# EAGLE design NU32v7 (EAGLE 7.3.0)
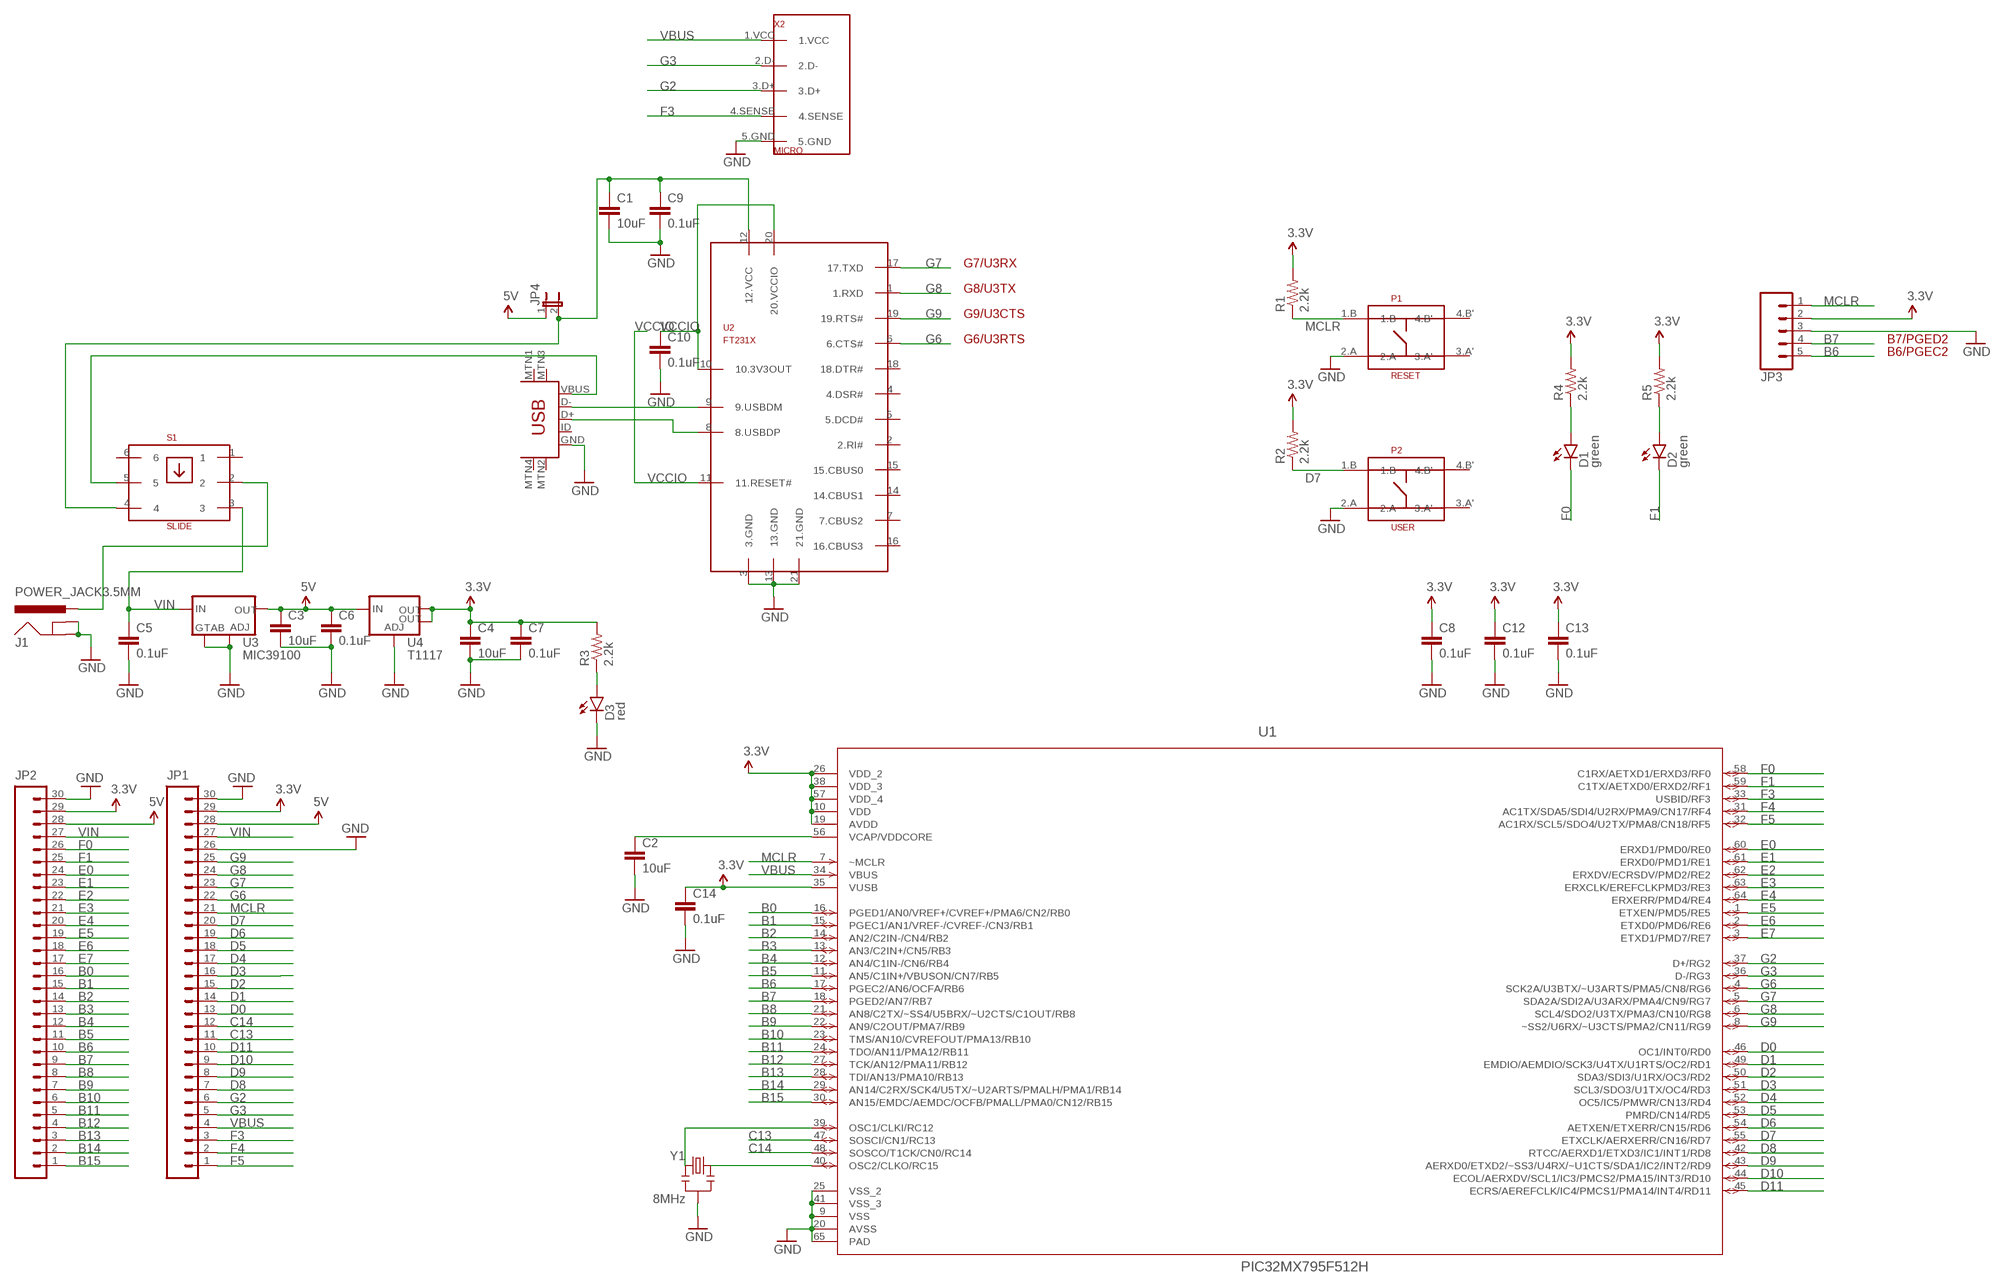
[diagram p0: schematic, sheet 1]

## Parts
C1  10uF  10UF-6.3V-20%(0603)  [0603-CAP]
C2  10uF  10UF-6.3V-20%(0603)  [0603-CAP]
C3  10uF  10UF-6.3V-20%(0603)  [0603-CAP]
C4  10uF  10UF-6.3V-20%(0603)  [0603-CAP]
C5  0.1uF  CAP0603-CAP  [0603-CAP]
C6  0.1uF  CAP0603-CAP  [0603-CAP]
C7  0.1uF  CAP0603-CAP  [0603-CAP]
C8  0.1uF  CAP0603-CAP  [0603-CAP]
C9  0.1uF  CAP0603-CAP  [0603-CAP]
C10  0.1uF  CAP0603-CAP  [0603-CAP]
C12  0.1uF  CAP0603-CAP  [0603-CAP]
C13  0.1uF  CAP0603-CAP  [0603-CAP]
C14  0.1uF  CAP0603-CAP  [0603-CAP]
D1  green  LED0603  [LED-0603]
D2  green  LED0603  [LED-0603]
D3  red  LED0603  [LED-0603]
J1  POWER_JACK3.5MM  [POWER_JACK_3.5MM]
JP1  M30NO_SILK  [1X30_NO_SILK]
JP2  M30NO_SILK  [1X30_NO_SILK]
JP3  M05PTH  [1X05]
JP4  JUMPER-2SMD-NO  [SJ_2S-NO]
P1  RESET  MOM_SW  [MOM_SW]
P2  USER  MOM_SW  [MOM_SW]
R1  2.2k  RESISTOR0603  [0603-RES]
R2  2.2k  RESISTOR0603  [0603-RES]
R3  2.2k  RESISTOR0603  [0603-RES]
R4  2.2k  RESISTOR0603  [0603-RES]
R5  2.2k  RESISTOR0603  [0603-RES]
S1  SLIDE  SLIDE_SW  [SLIDE_SW]
U1  PIC32MX795F512H  PIC32MX795F512H-80I/PTQFN  [QFN50P900X900X100-65N]
U2  FT231X  [QFN50P400X400X100-21N]
U3  MIC39100  [SOT223]
U4  T1117  V_REG_LM1117SOT223  [SOT223]
X1  MINI  USB-MINIB-5PIN  [USB-MINIB]
X2  MICRO  MICROUSB  [MICROUSB]
Y1  8MHz  RESONATORSMD  [RESONATOR-SMD]

## Nets
3.3V: C4.1 C7.1 C8.1 C12.1 C13.1 C14.1 JP1.29 JP2.29 JP3.2 R1.2 R2.2 R3.2 R4.2 R5.2 U1.10(VDD) U1.19(AVDD) U1.26(VDD_2) U1.35(VUSB) U1.38(VDD_3) U1.57(VDD_4) U4.2(OUT) U4.4(OUT)
5V: C3.1 C6.1 JP1.28 JP2.28 JP4.1 U3.3(OUT) U4.3(IN)
B0: JP2.16 U1.16(PGED1/AN0/VREF+/CVREF+/PMA6/CN2/RB0)
B1: JP2.15 U1.15(PGEC1/AN1/VREF-/CVREF-/CN3/RB1)
B2: JP2.14 U1.14(AN2/C2IN-/CN4/RB2)
B3: JP2.13 U1.13(AN3/C2IN+/CN5/RB3)
B4: JP2.12 U1.12(AN4/C1IN-/CN6/RB4)
B5: JP2.11 U1.11(AN5/C1IN+/VBUSON/CN7/RB5)
B6: JP2.10 JP3.5 U1.17(PGEC2/AN6/OCFA/RB6)
B7: JP2.9 JP3.4 U1.18(PGED2/AN7/RB7)
B8: JP2.8 U1.21(AN8/C2TX/~SS4/U5BRX/~U2CTS/C1OUT/RB8)
B9: JP2.7 U1.22(AN9/C2OUT/PMA7/RB9)
B10: JP2.6 U1.23(TMS/AN10/CVREFOUT/PMA13/RB10)
B11: JP2.5 U1.24(TDO/AN11/PMA12/RB11)
B12: JP2.4 U1.27(TCK/AN12/PMA11/RB12)
B13: JP2.3 U1.28(TDI/AN13/PMA10/RB13)
B14: JP2.2 U1.29(AN14/C2RX/SCK4/U5TX/~U2ARTS/PMALH/PMA1/RB14)
B15: JP2.1 U1.30(AN15/EMDC/AEMDC/OCFB/PMALL/PMA0/CN12/RB15)
C13: JP1.11 U1.47(SOSCI/CN1/RC13)
C14: JP1.12 U1.48(SOSCO/T1CK/CN0/RC14)
D0: JP1.13 U1.46(OC1/INT0/RD0)
D1: JP1.14 U1.49(EMDIO/AEMDIO/SCK3/U4TX/U1RTS/OC2/RD1)
D2: JP1.15 U1.50(SDA3/SDI3/U1RX/OC3/RD2)
D3: JP1.16 U1.51(SCL3/SDO3/U1TX/OC4/RD3)
D4: JP1.17 U1.52(OC5/IC5/PMWR/CN13/RD4)
D5: JP1.18 U1.53(PMRD/CN14/RD5)
D6: JP1.19 U1.54(AETXEN/ETXERR/CN15/RD6)
D7: JP1.20 P2.1.B R2.1 U1.55(ETXCLK/AERXERR/CN16/RD7)
D8: JP1.7 U1.42(RTCC/AERXD1/ETXD3/IC1/INT1/RD8)
D9: JP1.8 U1.43(AERXD0/ETXD2/~SS3/U4RX/~U1CTS/SDA1/IC2/INT2/RD9)
D10: JP1.9 U1.44(ECOL/AERXDV/SCL1/IC3/PMCS2/PMA15/INT3/RD10)
D11: JP1.10 U1.45(ECRS/AEREFCLK/IC4/PMCS1/PMA14/INT4/RD11)
E0: JP2.24 U1.60(ERXD1/PMD0/RE0)
E1: JP2.23 U1.61(ERXD0/PMD1/RE1)
E2: JP2.22 U1.62(ERXDV/ECRSDV/PMD2/RE2)
E3: JP2.21 U1.63(ERXCLK/EREFCLKPMD3/RE3)
E4: JP2.20 U1.64(ERXERR/PMD4/RE4)
E5: JP2.19 U1.1(ETXEN/PMD5/RE5)
E6: JP2.18 U1.2(ETXD0/PMD6/RE6)
E7: JP2.17 U1.3(ETXD1/PMD7/RE7)
F0: D1.C JP2.26 U1.58(C1RX/AETXD1/ERXD3/RF0)
F1: D2.C JP2.25 U1.59(C1TX/AETXD0/ERXD2/RF1)
F3: JP1.3 U1.33(USBID/RF3) X2.4.SENSE
F4: JP1.2 U1.31(AC1TX/SDA5/SDI4/U2RX/PMA9/CN17/RF4)
F5: JP1.1 U1.32(AC1RX/SCL5/SDO4/U2TX/PMA8/CN18/RF5)
G2: JP1.6 U1.37(D+/RG2) X2.3.D+
G3: JP1.5 U1.36(D-/RG3) X2.2.D-
G6: JP1.22 U1.4(SCK2A/U3BTX/~U3ARTS/PMA5/CN8/RG6) U2.6(6.CTS#)
G7: JP1.23 U1.5(SDA2A/SDI2A/U3ARX/PMA4/CN9/RG7) U2.17(17.TXD)
G8: JP1.24 U1.6(SCL4/SDO2/U3TX/PMA3/CN10/RG8) U2.1(1.RXD)
G9: JP1.25 U1.8(~SS2/U6RX/~U3CTS/PMA2/CN11/RG9) U2.19(19.RTS#)
GND: C1.2 C2.2 C3.2 C4.2 C5.2 C6.2 C7.2 C8.2 C9.2 C10.2 C12.2 C13.2 C14.2 D3.C J1.2.GND(GND) J1.3.GNDBREAK(GNDBREAK) JP1.26 JP1.30 JP2.30 JP3.3 P1.2.A P2.2.A U1.9(VSS) U1.20(AVSS) U1.25(VSS_2) U1.41(VSS_3) U1.65(PAD) U2.3(3.GND) U2.13(13.GND) U2.21(21.GND) U3.2(ADJ) U3.4(TAB) U4.1(ADJ) X1.GND X2.5.GND Y1.2
MCLR: JP1.21 JP3.1 P1.1.B R1.1 U1.7(~MCLR)
N$1: U1.40(OSC2/CLKO/RC15) Y1.1
N$2: U1.39(OSC1/CLKI/RC12) Y1.3
N$3: C2.1 U1.56(VCAP/VDDCORE)
N$4: S1.5 X1.VBUS
N$6: U2.9(9.USBDM) X1.D-
N$7: U2.8(8.USBDP) X1.D+
N$8: J1.1.POWER(PWR) S1.2
N$9: D3.A R3.1
N$11: C1.1 C9.1 JP4.2 S1.4 U2.12(12.VCC)
N$12: D1.A R4.1
N$13: D2.A R5.1
VBUS: JP1.4 U1.34(VBUS) X2.1.VCC
VCCIO: C10.1 U2.10(10.3V3OUT) U2.11(11.RESET#) U2.20(20.VCCIO)
VIN: C5.1 JP1.27 JP2.27 S1.3 U3.1(IN)
Unconnected: P1.3.A' P1.4.B' P2.3.A' P2.4.B' S1.1 S1.6 U2.2(2.RI#) U2.4(4.DSR#) U2.5(5.DCD#) U2.7(7.CBUS2) U2.14(14.CBUS1) U2.15(15.CBUS0) U2.16(16.CBUS3) U2.18(18.DTR#) X1.ID X1.MTN1(MTN2) X1.MTN2(MTN3) X1.MTN3(MTN1) X1.MTN4

## Notes on the sheet
- G7/U3RX
- G8/U3TX
- G9/U3CTS
- G6/U3RTS | B7/PGED2
- B6/PGEC2

## Library data of the parts
C1-C4 = SparkFun-Capacitors:10UF-6.3V-20%(0603): CAP-11015; PROD_ID: CAP-11015
C5-C10 C12-C14 = SparkFun-Capacitors:CAP: Capacitor Standard 0603 ceramic capacitor, and 0.1" leaded capacitor.
D1-D3 = SparkFun-LED:LED: LEDs Standard schematic elements and footprints for 5mm, 3mm, 1206, and 0603 sized LEDs. 5mm - Spark Fun Electronics SKU : COM-00529 (and others)
J1 = nu32v7:POWER_JACK: Power Jack This is the standard 5.5mm barrel jack for power. The PTH is the most common, proven, reliable, footprint. All others are experimental. The Slot footprint only works if the mill layer is transmitted to the PCB fab house so be warned. Spark Fun Electronics SKU : PRT-00119. Mating wall wart : TOL-00298 (and others)
JP1 JP2 = SparkFun-Connectors:M30: 1x30 .1" header
JP3 = SparkFun-Connectors:M05: Header 5 Standard 5-pin 0.1" header. Use with straight break away headers (SKU : PRT-00116), right angle break away headers (PRT-00553), swiss pins (PRT-00743), machine pins (PRT-00117), and female headers (PRT-00115). Molex polarized connector foot print use with SKU : PRT-08230 with associated crimp pins and housings.
JP4 = SparkFun:JUMPER-2: Jumper Basic 0.1" spaced jumper. Use with breakaway headers.
P1 P2 = nu32v7:MOM_SW
R1-R5 = SparkFun-Resistors:RESISTOR: Resistor Basic schematic elements and footprints for 0603, 1206, and PTH resistors.
S1 = nu32v7:SLIDE_SW
U1 = nu32v7:PIC32MX795F512H-80I/PT: IC, 32BIT MCU
U2 = nu32v7:FT231X
U3 = nu32v7:MIC39100
U4 = nu32v7:V_REG_LM1117: Voltage Regulator LM1117 Standard adjustable voltage regulator but in SMD form. Spark Fun Electronics SKU : COM-00595; PROD_ID: VREG-08170
X1 = nu32v7:USB-MINIB: Mini-USB "B" connector with 5th pin broken out. Created new symbol breaking out 5th "ID" pin in mini/micro USB connector spec. See: http://en.wikipedia.org/wiki/Mini_usb#Cables. Uses same footprint as 4-pin symbol. Also added pins to connect to mounting / shield pads if required (probably not generally needed as signals aren't shielded once they leave the connector).
X2 = nu32v7:MICROUSB
Y1 = nu32v7:RESONATOR: Resonator Small SMD resonator. This is the itty bitty 10/20MHz resonators with built in caps. CSTCE10M0G55 and CSTCE20M0V53. Footprint has been reviewed closely but hasn't been tested yet.

## Board
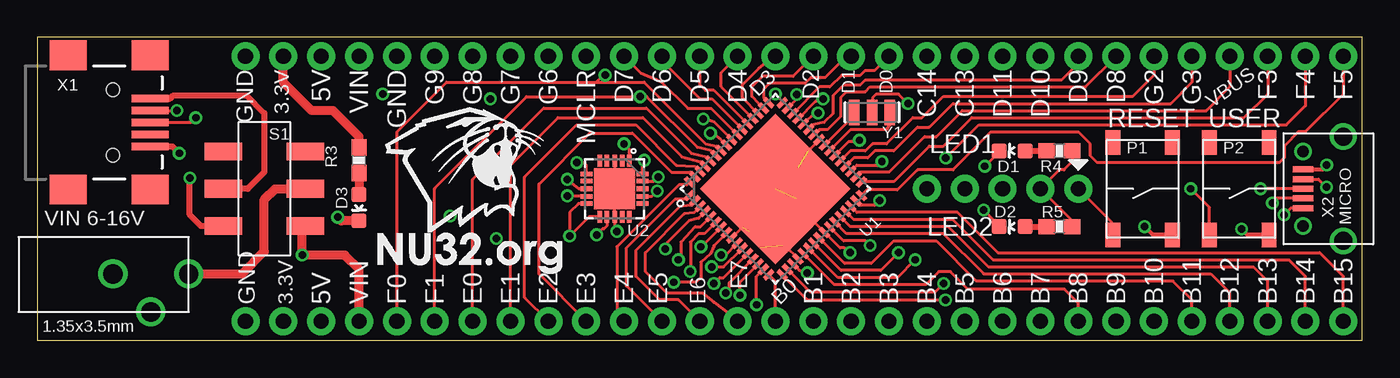
[diagram p1: board, top side]
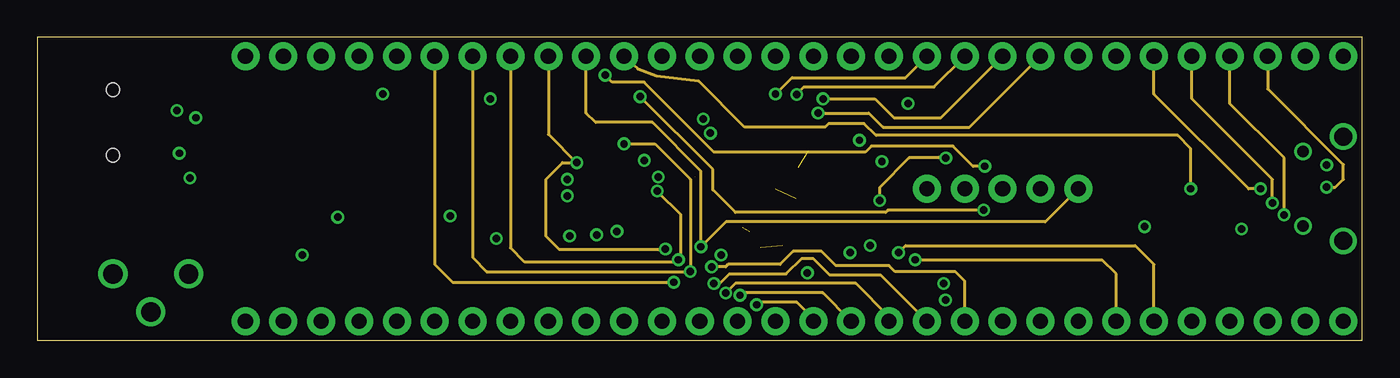
[diagram p2: board, inner layer Route2]
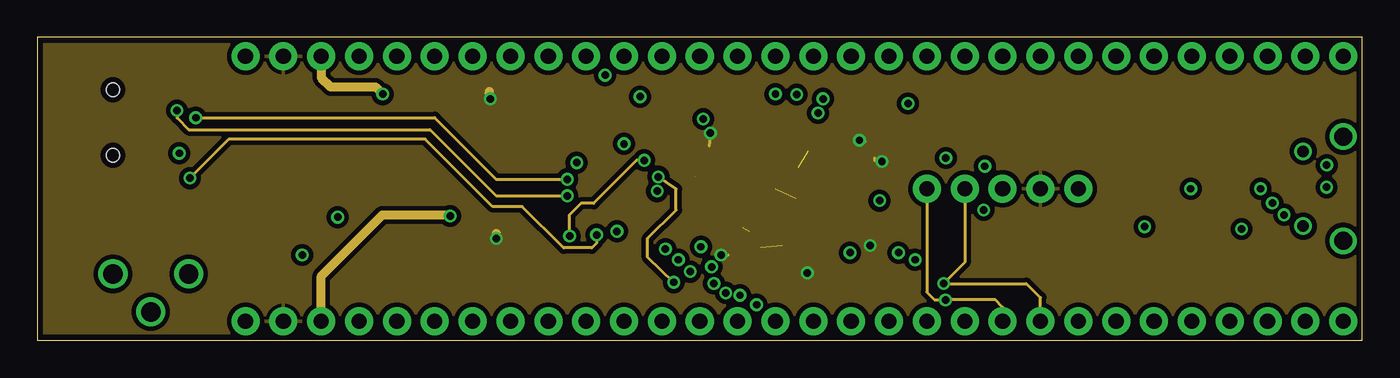
[diagram p3: board, inner layer Route15]
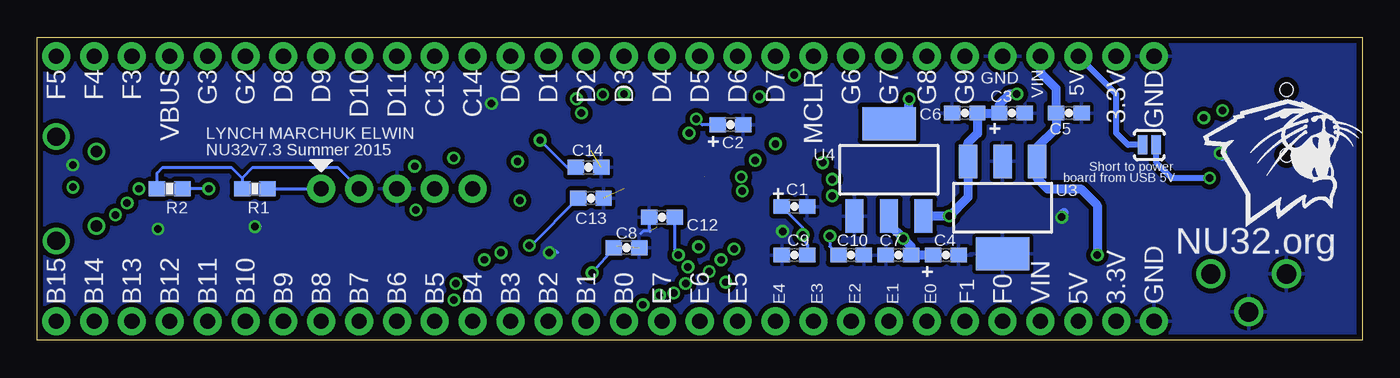
[diagram p4: board, bottom side, seen from below]

Size 88.9 x 20.32 mm. Coordinates in mm from the lower left corner, seen from the top.
Outline: 88.9,0 88.9,20.32 0,20.32 0,0 88.9,0
Copper layers (1*16): Top 0.0356mm / dielectric 1.5011mm / Bottom 0.0356mm
Design rules "LaenPCBOrder": minimum track width 6mil, minimum drill 13mil, track to track 6mil, track to pad 6mil, pad to pad 6mil, via to via 6mil, smd to smd 6mil, copper to edge 15mil, drill to drill 6mil, minimum pad ring 7mil, minimum via ring 7mil, stop-mask expansion 3mil, vias tented up to drill 0mil, thermal gap 10mil

### Footprints (pad centres in the part's own frame; a part is rotated, then mirrored left to right if it is on the bottom)
0603-CAP = smd 1.1 x 1: 1 -0.85,0; 2 0.85,0
LED-0603 = smd 1 x 1: A 0,-0.877; C 0,0.877
POWER_JACK_3.5MM = drill 1.3: 1.POWER 2.54,0; 2.GND 2.54,5.08; 3.GNDBREAK 0,2.54
1X30_NO_SILK = drill 1.016 pad 1.88: 1 0,0; 2 2.54,0; 3 5.08,0; 4 7.62,0; 5 10.16,0; 6 12.7,0; 7 15.24,0; 8 17.78,0; 9 20.32,0; 10 22.86,0; 11 25.4,0; 12 27.94,0; 13 30.48,0; 14 33.02,0; 15 35.56,0; 16 38.1,0; 17 40.64,0; 18 43.18,0; 19 45.72,0; 20 48.26,0; 21 50.8,0; 22 53.34,0; 23 55.88,0; 24 58.42,0; 25 60.96,0; 26 63.5,0; 27 66.04,0; 28 68.58,0; 29 71.12,0; 30 73.66,0
1X05 = drill 1.016 pad 1.88: 1 0,0; 2 2.54,0; 3 5.08,0; 4 7.62,0; 5 10.16,0
SJ_2S-NO = smd 0.635 x 1.27: 1 -0.45,0; 2 0.45,0
MOM_SW = smd 1.65 x 1: 1.B -3.1,2; 2.A -3.1,-2; 3.A' 3.1,-2; 4.B' 3.1,2
0603-RES = smd 1.1 x 1: 1 -0.85,0; 2 0.85,0
SLIDE_SW = smd 1.2 x 2.5: 1 -2.5,2.75; 2 0,2.75; 3 2.5,2.75; 4 2.5,-2.75; 5 0,-2.75; 6 -2.5,-2.75
QFN50P900X900X100-65N = smd 0.813 x 0.305: 1 -4.394,3.759; 2 -4.394,3.251; 3 -4.394,2.743; 4 -4.394,2.261; 5 -4.394,1.753; 6 -4.394,1.245; 7 -4.394,0.762; 8 -4.394,0.254; 9 -4.394,-0.254; 10 -4.394,-0.762; 11 -4.394,-1.245; 12 -4.394,-1.753; 13 -4.394,-2.261; 14 -4.394,-2.743; 15 -4.394,-3.251; 16 -4.394,-3.759; 33 4.394,-3.759; 34 4.394,-3.251; 35 4.394,-2.743; 36 4.394,-2.261; 37 4.394,-1.753; 38 4.394,-1.245; 39 4.394,-0.762; 40 4.394,-0.254; 41 4.394,0.254; 42 4.394,0.762; 43 4.394,1.245; 44 4.394,1.753; 45 4.394,2.261; 46 4.394,2.743; 47 4.394,3.251; 48 4.394,3.759 | smd 0.305 x 0.813: 17 -3.759,-4.394; 18 -3.251,-4.394; 19 -2.743,-4.394; 20 -2.261,-4.394; 21 -1.753,-4.394; 22 -1.245,-4.394; 23 -0.762,-4.394; 24 -0.254,-4.394; 25 0.254,-4.394; 26 0.762,-4.394; 27 1.245,-4.394; 28 1.753,-4.394; 29 2.261,-4.394; 30 2.743,-4.394; 31 3.251,-4.394; 32 3.759,-4.394; 49 3.759,4.394; 50 3.251,4.394; 51 2.743,4.394; 52 2.261,4.394; 53 1.753,4.394; 54 1.245,4.394; 55 0.762,4.394; 56 0.254,4.394; 57 -0.254,4.394; 58 -0.762,4.394; 59 -1.245,4.394; 60 -1.753,4.394; 61 -2.261,4.394; 62 -2.743,4.394; 63 -3.251,4.394; 64 -3.759,4.394 | smd 7.137 x 7.137: 65 0,0
QFN50P400X400X100-21N = smd 0.813 x 0.305: 1 -1.88,0.991; 2 -1.88,0.508; 3 -1.88,0; 4 -1.88,-0.508; 5 -1.88,-0.991; 11 1.88,-0.991; 12 1.88,-0.508; 13 1.88,0; 14 1.88,0.508; 15 1.88,0.991 | smd 0.305 x 0.813: 6 -0.991,-1.88; 7 -0.508,-1.88; 8 0,-1.88; 9 0.508,-1.88; 10 0.991,-1.88; 16 0.991,1.88; 17 0.508,1.88; 18 0,1.88; 19 -0.508,1.88; 20 -0.991,1.88 | smd 2.743 x 2.743: 21 0,0
SOT223 = smd 1.219 x 2.235: 1 -2.311,-3.099; 2 0,-3.099; 3 2.311,-3.099 | smd 3.6 x 2.2: 4 0,3.099
USB-MINIB = smd 2.5 x 0.5: D+ 2.5,0; D- 2.5,0.8; GND 2.5,-1.6; ID 2.5,-0.8; VBUS 2.5,1.6 | smd 2.5 x 2: MTN1 -3,4.5; MTN2 2.5,4.5; MTN3 -3,-4.5; MTN4 2.5,-4.5 | hole 0.9: 0,2.2; 0,-2.2
MICROUSB = smd 0.4 x 1.35: 1.VCC -1.3,2.7; 2.D- -0.65,2.7; 3.D+ 0,2.7; 4.SENSE 0.65,2.7; 5.GND 1.3,2.7 | drill 0.8: 10 -2.5,2.7; 11 2.5,2.7 | drill 1.2: 12 -3.5,0; 13 3.5,0
RESONATOR-SMD = smd 0.7 x 1.7: 1 -1.2,0; 2 0,0; 3 1.2,0

### Placement (x,y rotation side)
C1  38.1,8.97 0 bottom
C2  42.39,14.45 0 bottom
C3  23.5,15.24 0 bottom
C4  27.94,5.71 0 bottom
C5  19.68,15.24 0 bottom
C6  26.67,15.24 180 bottom
C7  31.11,5.71 180 bottom
C8  49.37,6.19 0 bottom
C9  38.1,5.71 180 bottom
C10  34.29,5.71 0 bottom
C12  46.99,8.26 180 bottom
C13  51.75,9.53 0 bottom
C14  51.91,11.59 0 bottom
D1  65.41,12.7 90 top
D2  65.41,7.62 90 top
D3  21.59,8.89 180 top
J1  10.16,1.91 90 top
JP1  87.63,19.05 180 top
JP2  87.63,1.27 180 top
JP3  69.85,10.16 180 top
JP4  14.29,13.1 0 bottom
P1  74.17,10.16 90 top
P2  80.64,10.16 90 top
R1  74.3,10.16 180 bottom
R2  80.01,10.16 180 bottom
R3  21.59,12.06 90 top
R4  68.58,12.7 0 top
R5  68.58,7.62 0 top
S1  15.24,10.16 270 top
U1  49.53,10.16 45 top
U2  38.73,10.16 270 top
U3  24.13,8.89 180 bottom
U4  31.75,11.43 0 bottom
X1  5.08,14.61 0 top
X2  87.63,10.16 90 top
Y1  56.01,15.28 0 top

### Tracks (layer width: path | path; a pad name or v marks a point on that pad's centre or on a via)
3.3V  (via drill 0.5)
  Top 0.203: 46.96,6.48 U1.10 46.16,5.71 v45.88,5.71 | v51.67,4.52 51.13,4.68 U1.19 | 46.24,13.13 U1.57 45.84,13.49 45.4,13.81 v45.16,13.89 | 53.21,7.59 U1.26 54.1,6.67 55.56,6.67 v55.88,6.35 | v56.67,11.99 56.44,11.75 55,11.75 U1.35 | R4.2 69.43,11.96 68.9,11.43 68.58,11.43 JP3.2 69.43,8.04 R5.2 | U1.38 54.45,13.34 55.09,13.34 v55.17,13.41
  Top 0.61: R3.2 21.59,13.65 19.84,15.4 18.41,15.4 16.51,17.3 JP1.29
  Route15 0.203: v45.88,5.71 46.35,5.71 | v51.67,4.52 51.91,4.76 | v45.16,13.89 45.09,13.02 | v56.67,11.99 56.2,12.06 56.2,12.22 | v55.17,13.41 55.4,13.49 55.56,13.34
  Route15 0.61: v30.8,6.83 30.8,7.14 | v30.4,16.19 30.32,16.67
  Bottom 0.203: JP3.2 68.74,11.59 74.45,11.59 75.17,10.87 | C8.1 50.22,6.13 v51.67,4.52 | C12.1 46.14,5.98 v45.88,5.71 | C14.1 53.34,11.59 v55.17,13.41 | v55.88,6.35 55.78,6.35 C13.1 | 75.17,10.87 75.17,10.18 R1.2 | R2.2 80.86,11.21 80.49,11.59 75.88,11.59 75.17,10.87
  Bottom 0.61: C4.1 C7.1 30.27,6.29 v30.8,6.83 31.75,7.78 U4.2 | U4.4 31.03,14.53 30.4,15 v30.4,16.19
  pour Route15 (isolate 0.305): 0,20.32 88.9,20.32 88.9,0 0,0
5V  (via drill 0.5)
  Route15 0.61: JP1.28 19.05,17.62 19.68,16.99 22.7,16.99 v23.18,16.51 | JP2.28 19.05,4.3 23.17,8.41 27.62,8.41 v27.7,8.33
  Bottom 0.406: JP4.1 15.72,13.1 16.51,13.89 16.51,16.51 JP1.28
  Bottom 0.61: v23.18,16.51 23.65,16.51 24.34,15.82 C3.1 C6.1 25.82,13.87 26.44,13.25 U3.3 26.44,9.6 v27.7,8.33 U4.3
B0
  Top 0.203: JP2.16 49.53,3.95 U1.16
B1  (via drill 0.5)
  Top 0.203: v48.26,2.38 48.26,4.29 U1.15
  Route2 0.203: JP2.15 52.07,1.43 50.96,2.54 48.42,2.54 v48.26,2.38
B2  (via drill 0.5)
  Top 0.203: v47.15,3.02 47.15,3.9 U1.14
  Route2 0.203: JP2.14 52.7,3.17 47.31,3.17 v47.15,3.02
B3  (via drill 0.5)
  Top 0.203: v46.2,3.17 46.43,3.41 46.43,3.87 U1.13
  Route2 0.203: JP2.13 57.15,1.59 54.93,3.81 46.83,3.81 v46.2,3.17
B4  (via drill 0.5)
  Top 0.203: v45.4,3.81 45.8,4.21 46.05,4.21 U1.12
  Route2 0.203: JP2.12 56.59,4.37 53.18,4.37 52.07,5.48 51.28,5.48 50.24,4.45 46.43,4.45 45.8,3.81 v45.4,3.81
B5  (via drill 0.5)
  Top 0.203: v45.24,4.92 46.05,4.92 U1.11
  Route2 0.203: JP2.11 62.23,3.97 61.59,4.6 57.55,4.6 57.15,5 53.58,5 52.63,5.95 50.72,5.95 49.85,5.08 46.35,5.08 46.2,4.92 v45.24,4.92
B6  (via drill 0.5)
  Top 0.203: U1.17 51.36,3.02 51.36,3.01 51.67,2.7 59.37,2.7 v60.94,2.71
  Route15 0.203: JP2.10 64.77,2.22 64.29,2.7 61.25,2.7 v60.94,2.71 v60.93,2.7 60.21,2.7 59.69,3.22 JP3.5
B7  (via drill 0.5)
  Top 0.203: U1.18 51.6,3.49 51.83,3.25 60.26,3.25 v60.81,3.8
  Route15 0.203: JP2.9 67.31,2.86 66.36,3.8 v60.81,3.8 62.23,5.23 JP3.4
B8
  Top 0.203: JP2.8 69.85,2.49 68.92,3.42 62.46,3.42 61.28,4.6 60.48,4.6 59.61,3.73 53.48,3.73 U1.21
B9  (via drill 0.5)
  Top 0.203: v58.9,5.4 57.71,4.21 53.72,4.21 U1.22
  Route2 0.203: JP2.7 72.39,4.45 71.44,5.4 v58.9,5.4
B10  (via drill 0.5)
  Top 0.203: v57.78,5.87 56.59,4.68 53.93,4.68 U1.23
  Route2 0.203: JP2.6 74.93,5.08 73.66,6.35 58.26,6.35 v57.78,5.87
B11
  Top 0.203: JP2.5 77.47,2.7 76.2,3.97 63.02,3.97 60.33,6.67 57.47,6.67 55.96,5.16 54.17,5.16 U1.24
B12
  Top 0.203: JP2.4 80.01,3.17 78.74,4.45 63.5,4.45 60.8,7.14 54.31,7.14 U1.27
B13
  Top 0.203: JP2.3 82.55,3.97 81.6,4.92 63.82,4.92 61.12,7.62 54.55,7.62 U1.28
B14
  Top 0.203: JP2.2 85.09,4.29 83.98,5.4 64.14,5.4 61.44,8.1 54.79,8.1 U1.29
B15
  Top 0.203: JP2.1 87.63,4.29 86.04,5.87 64.45,5.87 61.75,8.57 55,8.57 U1.30
C13  (via drill 0.5)
  Top 0.203: U1.47 50.96,16.19 v50.96,16.48
  Route2 0.203: v50.96,16.48 51.44,16.99 60.17,16.99 JP1.11
C14  (via drill 0.5)
  Top 0.203: U1.48 49.98,16.06 v49.53,16.51
  Route2 0.203: v49.53,16.51 50.64,17.62 58.26,17.62 JP1.12
D0
  Top 0.203: U1.46 52.48,16.99 53.18,16.99 53.98,17.78 55.24,17.78 55.56,18.1 56.2,18.1 JP1.13
D1
  Top 0.203: U1.49 48.74,16.27 48.74,16.83 49.13,17.22 51.51,17.22 51.91,17.62 52.86,17.62 54.13,18.89 54.45,18.89 JP1.14
D2
  Top 0.203: JP1.15 50.72,17.7 48.66,17.7 47.94,16.99 47.94,16.35 48.42,15.88 48.42,15.87 U1.50
D3
  Top 0.203: U1.51 47.31,16.26 47.31,17.14 48.42,18.26 49.21,18.89 JP1.16
D4
  Top 0.203: JP1.17 45.88,17.94 45.88,17.01 U1.52
D5
  Top 0.203: U1.53 45.4,16.77 44.83,16.77 44.45,17.14 JP1.18
D6
  Top 0.203: U1.54 45.26,16.19 44.45,16.19 41.91,18.73 JP1.19
D7  (via drill 0.5)
  Top 0.203: U1.55 45.21,15.56 43.66,15.56 41.83,17.38 40.48,17.94 JP1.20 | P2.1.B 78.64,8.91 v77.39,10.16
  Route2 0.203: v77.39,10.16 77.39,12.86 76.52,13.73 56.28,13.73 55.48,14.53 53.1,14.53 52.86,14.29 47.47,14.29 44.36,17.39 41.54,17.74 40.29,18.2 JP1.20
  Bottom 0.203: v77.39,10.16 R2.1
D8
  Top 0.203: JP1.7 70.33,16.99 55.88,16.99 55.56,16.67 54.29,16.67 53.9,16.27 53.9,15 53.02,14.13 52.47,14.13 U1.42
D9
  Top 0.203: JP1.8 69.85,18.57 68.74,17.46 55.56,17.46 55.24,17.14 54.13,17.14 53.42,16.43 53.42,15.24 52.78,14.61 52.06,14.45 U1.43
D10  (via drill 0.5)
  Top 0.203: v52.39,15.24 52.13,15.24 U1.44
  Route2 0.203: v52.39,15.24 55.8,15.24 56.75,14.29 62.55,14.29 JP1.9
D11  (via drill 0.5)
  Top 0.203: U1.45 51.06,14.87 52.23,16.03 v52.72,16.19
  Route2 0.203: JP1.10 60.64,14.92 57.47,14.92 56.2,16.19 v52.72,16.19
E0
  Top 0.203: U1.60 44.91,12.3 43.89,12.54 40.88,15.56 33.98,15.56 29.21,10.79 JP2.24
E1
  Top 0.203: U1.61 44.51,11.99 43.26,12.3 40.64,14.93 34.93,14.93 31.75,11.75 JP2.23
E2
  Top 0.203: U1.62 44.14,11.67 42.86,11.75 40.16,14.45 36.2,14.45 32.7,10.95 32.7,2.86 JP2.22
E3  (1 unrouted)
  Top 0.203: 44.13,10.95 43.81,11.27 42.55,11.27 39.93,13.89 37.07,13.89 33.66,10.48 33.66,4.45 JP2.21
E4
  Top 0.203: U1.64 43.58,10.42 43.04,10.42 38.89,6.27 38.89,1.75 JP2.20
E5
  Top 0.203: JP2.19 39.53,3.65 39.53,6.19 42.78,9.44 43.5,9.44 U1.1
E6
  Top 0.203: JP2.18 43.02,2.7 41.75,2.7 40.16,4.29 40.16,6.03 43.09,8.96 43.81,9.04 U1.2
E7
  Top 0.203: U1.3 44.05,8.56 43.41,8.48 40.8,5.87 40.8,4.6 42.23,3.17 44.61,3.17 45.4,2.54 46.67,1.59 JP2.17
F0  (via drill 0.5)
  Top 0.203: U1.58 45.59,13.02 44.85,13.18 40.72,17.3 37.49,17.3 | JP2.26 24.13,13.97 27.46,17.3 37.49,17.3 | D1.C 64.53,12.62 v63.58,11.67 | v38.1,17.78 37.97,17.78 37.49,17.3
  Route2 0.203: v63.58,11.67 62.79,11.67 61.44,13.02 55.96,13.02 55.56,12.62 45.4,12.62 40.72,17.3 38.58,17.3 v38.1,17.78
F1  (via drill 0.5)
  Top 0.203: U1.59 45.23,12.7 44.29,12.94 40.89,16.34 v40.45,16.34 32.83,16.34 26.67,10.18 JP2.25 | D2.C 64.53,7.7 v63.5,8.73
  Route2 0.203: v63.5,8.73 57.07,8.73 56.91,8.57 46.83,8.57 45.32,10.08 45.32,11.46 v40.45,16.34
F3  (via drill 0.5)
  Top 0.203: JP1.3 82.55,16.51 80.96,14.92 62.71,14.92 60.8,13.02 59.85,13.02 57.47,10.64 55.32,10.64 U1.33 | X2.4.SENSE 85.96,10.81 v86.5,10.27
  Route2 0.203: v86.5,10.27 87.1,10.27 87.63,10.79 87.63,11.78 82.55,16.86 JP1.3
F4  (via drill 0.5)
  Top 0.203: JP1.2 85.09,15.72 83.82,14.45 63.18,14.45 v60.96,12.22 | v56.52,9.37 56.2,9.05 55.24,9.05 U1.31
  Route2 0.203: v60.96,12.22 58.5,12.22 56.52,10.24 v56.52,9.37
F5
  Top 0.203: JP1.1 87.63,16.51 85.09,13.97 84.61,13.97 83.66,13.02 83.66,12.22 83.34,11.91 71.12,11.91 70.64,12.38 70.64,13.18 69.85,13.97 63.98,13.97 61.44,11.43 59.05,11.43 57.71,10.08 55.66,10.08 U1.32
G2  (via drill 0.5)
  Top 0.203: JP1.6 74.93,17.78 73.5,16.35 60.8,16.35 59.37,14.92 58.74,14.92 56.99,13.18 56.04,13.18 55.56,12.7 54.55,12.7 U1.37 | X2.3.D+ v82.07,10.16
  Route2 0.203: v82.07,10.16 81.28,10.16 74.93,16.51 JP1.6
G3  (via drill 0.5)
  Top 0.203: JP1.5 77.47,17.3 76.04,15.88 61.44,15.88 59.85,14.29 59.05,14.29 57.47,12.7 56.2,12.7 55.72,12.22 54.79,12.22 U1.36 | X2.2.D- 83.17,9.51 v82.87,9.21
  Route2 0.203: v82.87,9.21 82.87,10.79 77.47,16.19 JP1.5
G6  (via drill 0.5)
  Top 0.203: v36.2,11.91 36.67,11.91 36.83,11.75 36.83,11.18 U2.6 | U1.4 44.82,8.63 44.37,8.18 43.74,8.02 42.15,6.43 v42.15,6.11
  Route2 0.203: JP1.22 34.29,13.81 v36.2,11.91 35.24,11.91 34.13,10.79 34.13,6.99 35,6.11 v42.15,6.11
G7  (via drill 0.5)
  Top 0.203: U1.5 44.51,7.62 44.13,7.62 43.18,6.59 43.18,5.56 v43.02,5.4 | U2.17 41.24,9.65 v41.59,10
  Route2 0.203: JP1.23 31.75,6.19 32.7,5.24 42.86,5.24 v43.02,5.4 43.18,5.56 43.18,8.41 v41.59,10
G8  (via drill 0.5)
  Top 0.203: U1.6 45.54,7.92 44.77,7.14 44.37,7.14 43.81,6.59 v43.81,4.6 | U2.1 39.73,12.82 v39.37,13.18
  Route2 0.203: JP1.24 29.21,5.56 30.16,4.6 v43.81,4.6 43.81,10.79 41.43,13.18 v39.37,13.18
G9  (via drill 0.5)
  Top 0.203: U1.8 46.24,7.19 45.4,6.35 45.16,5.79 44.53,5.24 44.53,4.21 44.21,3.89 v42.7,3.89 | U2.19 41.39,10.67 v41.67,10.95
  Route2 0.203: JP1.25 26.67,5.08 27.86,3.89 v42.7,3.89
  Route15 0.203: v42.7,3.89 40.96,5.56 40.96,6.83 42.86,8.73 42.86,10.15 v41.67,10.95
GND  (via drill 0.5)  (4 unrouted)
  Top 0.203: U2.3 U2.21 U2.13 38.73,7.46 v38.89,7.3 | 46.6,6.92 U1.9 47.31,7.58 47.31,7.62 | v58.42,15.88 57.78,16.51 56.28,16.51 56.04,16.27 56.04,15.32 Y1.2 | U1.41 52.46,13.4 51.75,12.7 | U1.25 52.82,7.19 | v54.53,5.87 54.13,6.19 53.86,6.19 U1.25 | 51.91,8.1 51.91,7.94 52.11,7.94 U1.25 | 51.04,5.48 U1.20 51.06,5.45 | 50.01,6.35 50.16,6.35 51.06,5.45 | 51.06,5.45 51.12,5.4
  Top 0.254: P1.2.A 74.86,7.06 v74.3,7.62 | P2.2.A 81.2,7.06 v80.8,7.46 | X2.5.GND 86.23,11.46 v86.52,11.75
  Top 0.406: X1.GND 9.06,13.01 v9.53,12.54
  Top 0.61: D3.C 20.4,8.01 v20.16,8.26
  Bottom 0.203: v38.89,7.3 38.89,6.99 | v58.42,15.88 58.1,15.88 | v54.53,5.87 54.13,6.03 53.98,5.87 | C12.2 47.84,7.36 47.78,7.3 48.26,7.3 48.42,7.14
  Bottom 0.254: v74.3,7.62 73.98,7.62 | v80.8,7.46 80.64,7.62 | v86.52,11.75 86.52,12.06
  Bottom 0.406: v9.53,12.54 9.53,12.38 9.37,12.22
  Bottom 0.61: v20.16,8.26 20.16,8.41 20,8.57
  pour Bottom (isolate 0.305): 0,20.32 88.9,20.32 88.9,0 0,0
MCLR  (via drill 0.5)
  Top 0.203: v44.53,6.27 44.96,6.67 U1.7 | JP3.1 72.07,7.94 72.07,7.16 P1.1.B
  Route2 0.203: JP3.1 67.63,7.94 46.2,7.94 v44.53,6.27 44.53,11.35 41.27,14.61 37.47,14.61 36.83,15.24 JP1.21
  Bottom 0.203: R1.1 JP3.1
N$1
  Top 0.203: Y1.1 54.68,14.95 U1.40
N$2
  Top 0.203: U1.39 54.58,14.13 56.99,14.13 57.16,14.38 Y1.3
N$3  (via drill 0.5)
  Top 0.203: v44.69,14.84 45.44,14.61 U1.56
  Bottom 0.203: C2.1 44.29,14.45 v44.69,14.84
N$4
  Top 0.406: X1.VBUS 8.9,16.2 9.13,16.43 14.05,16.43 15.24,15.24 15.24,11.27 14.13,10.16 S1.5
N$6  (via drill 0.5)
  Top 0.203: X1.D- v9.37,15.4 | U2.9 35.59,9.65 v35.56,9.68
  Route15 0.203: v9.37,15.4 9.37,14.92 10.16,14.13 26.35,14.13 30.8,9.68 v35.56,9.68
N$7  (via drill 0.5)
  Top 0.203: X1.D+ 10.32,14.61 v10.64,14.92 | U2.8 36.35,10.16 v35.56,10.79
  Route15 0.203: v10.64,14.92 26.67,14.92 30.8,10.79 v35.56,10.79
N$8
  Top 0.61: J1.1.POWER 13.73,4.45 15.24,5.95 15.24,9.45 15.95,10.16 S1.2
N$9
  Top 0.61: R3.1 D3.A
N$11  (via drill 0.5)
  Top 0.203: U2.12 38.23,7.67 38.02,7.46 37.92,7.46 v37.53,7.07
  Top 0.406: S1.4 10.99,7.66 10.24,8.41 v10.24,10.87
  Route15 0.203: v37.53,7.07 37.53,6.51 37.21,6.19 35.32,6.19 32.54,8.97 30.56,8.97 26.04,13.49 12.86,13.49 v10.24,10.87
  Bottom 0.203: C9.1 37.23,5.74 37.23,6.43 37.53,6.75 v37.53,7.07 37.53,7.55 C1.1 38.92,8.97
  Bottom 0.406: v10.24,10.87 12.78,10.87 13.81,11.91 13.81,13.07 JP4.2
N$12
  Top 0.406: D1.A R4.1
N$13
  Top 0.406: D2.A R5.1
VBUS  (via drill 0.5)
  Top 0.203: JP1.4 80.01,16.99 78.42,15.4 62.07,15.4 60.33,13.65 59.53,13.65 57.15,11.27 55.24,11.27 U1.34 | X2.1.VCC 84.11,8.86 v83.66,8.41
  Route2 0.203: v83.66,8.41 83.66,12.22 80.01,15.88 JP1.4
VCCIO  (via drill 0.5)
  Top 0.203: 36.83,9.14 U2.10 36.32,9.17 35.72,8.57 v35.72,6.99 37.01,8.28 U2.11 | U2.20 40.62,11.96 v40.72,12.06
  Route15 0.203: v35.72,6.99 35.72,8.42 36.48,9.18 37.34,9.18 40.22,12.06 v40.72,12.06
  Bottom 0.203: v35.72,6.99 35.72,6.29 C10.1
VIN  (via drill 0.5)
  Top 0.61: JP2.27 21.59,4.76 20.64,5.71 v17.78,5.71 17.78,7.45 S1.3
  Bottom 0.61: JP1.27 21.59,17.94 20.54,16.88 C5.1 20.54,14.23 21.82,12.95 U3.1 21.82,10.87 21.11,10.16 18.89,10.16 17.78,9.05 v17.78,5.71

### Text on the board
tPlace: GND | 3.3V | 5V | VIN | GND | G9 | G8 | G7 | G6 | MCLR | D7 | D6 | D5 | D4 | D3 | D2 | D1 | D0 | C14 | C13 | D11 | D10 | D9 | D8 | G2 | G3 | VBUS | F3 | F4 | F5 | LED1 | VIN 6-16V | LED2 | E7 | GND | 3.3V | 5V | VIN | F0 | F1 | E0 | E1 | E2 | E3 | E4 | E5 | E6 | B0 | B1 | B2 | B3 | B4 | B5 | B6 | B7 | B8 | B9 | B10 | B11 | B12 | B13 | B14 | B15 | 1.35x3.5mm
bPlace: GND | 3.3V | 5V | VIN | GND | G9 | G8 | G7 | G6 | MCLR | D7 | D6 | D5 | D4 | D3 | D2 | D1 | D0 | C14 | C13 | D11 | D10 | D9 | D8 | G2 | G3 | VBUS | F3 | F4 | F5 | + | + | LYNCH MARCHUK ELWIN | NU32v7.3 Summer 2015 | Short to power | board from USB 5V | + | NU32.org | + | GND | 3.3V | 5V | VIN | F0 | F1 | E0 | E1 | E2 | E3 | E4 | E5 | E6 | E7 | B0 | B1 | B2 | B3 | B4 | B5 | B6 | B7 | B8 | B9 | B10 | B11 | B12 | B13 | B14 | B15